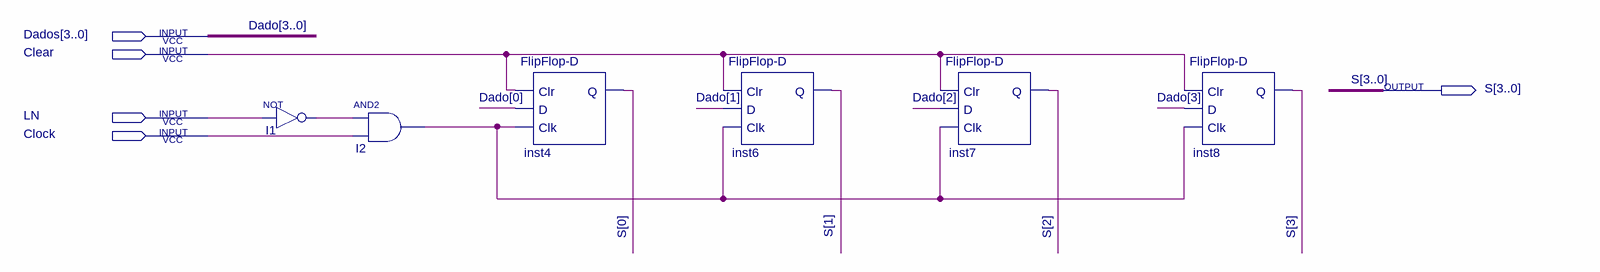
[diagram p0: schematic sheet]
// Quartus schematic REM.bdf as structural Verilog: 6 symbols, 5 pins
module REM (
  input  [3:0] Dados,
  input  Clear,
  input  LN,
  input  Clock,
  output [3:0] S
);

  wire I1_out, I2_out;

  not I1 (I1_out, LN);
  and I2 (I2_out, I1_out, Clock);
  \FlipFlop-D  inst4 (.Clr(Clear), .D(Dados[0]), .Clk(I2_out), .Q(S[0]));
  \FlipFlop-D  inst6 (.Clr(Clear), .D(Dados[1]), .Clk(I2_out), .Q(S[1]));
  \FlipFlop-D  inst7 (.Clr(Clear), .D(Dados[2]), .Clk(I2_out), .Q(S[2]));
  \FlipFlop-D  inst8 (.Clr(Clear), .D(Dados[3]), .Clk(I2_out), .Q(S[3]));

  // Other names for the same wires on the sheet: Dado[3:0] = Dados
endmodule
